# EAGLE design FloppyController1A (EAGLE 7.3.0)
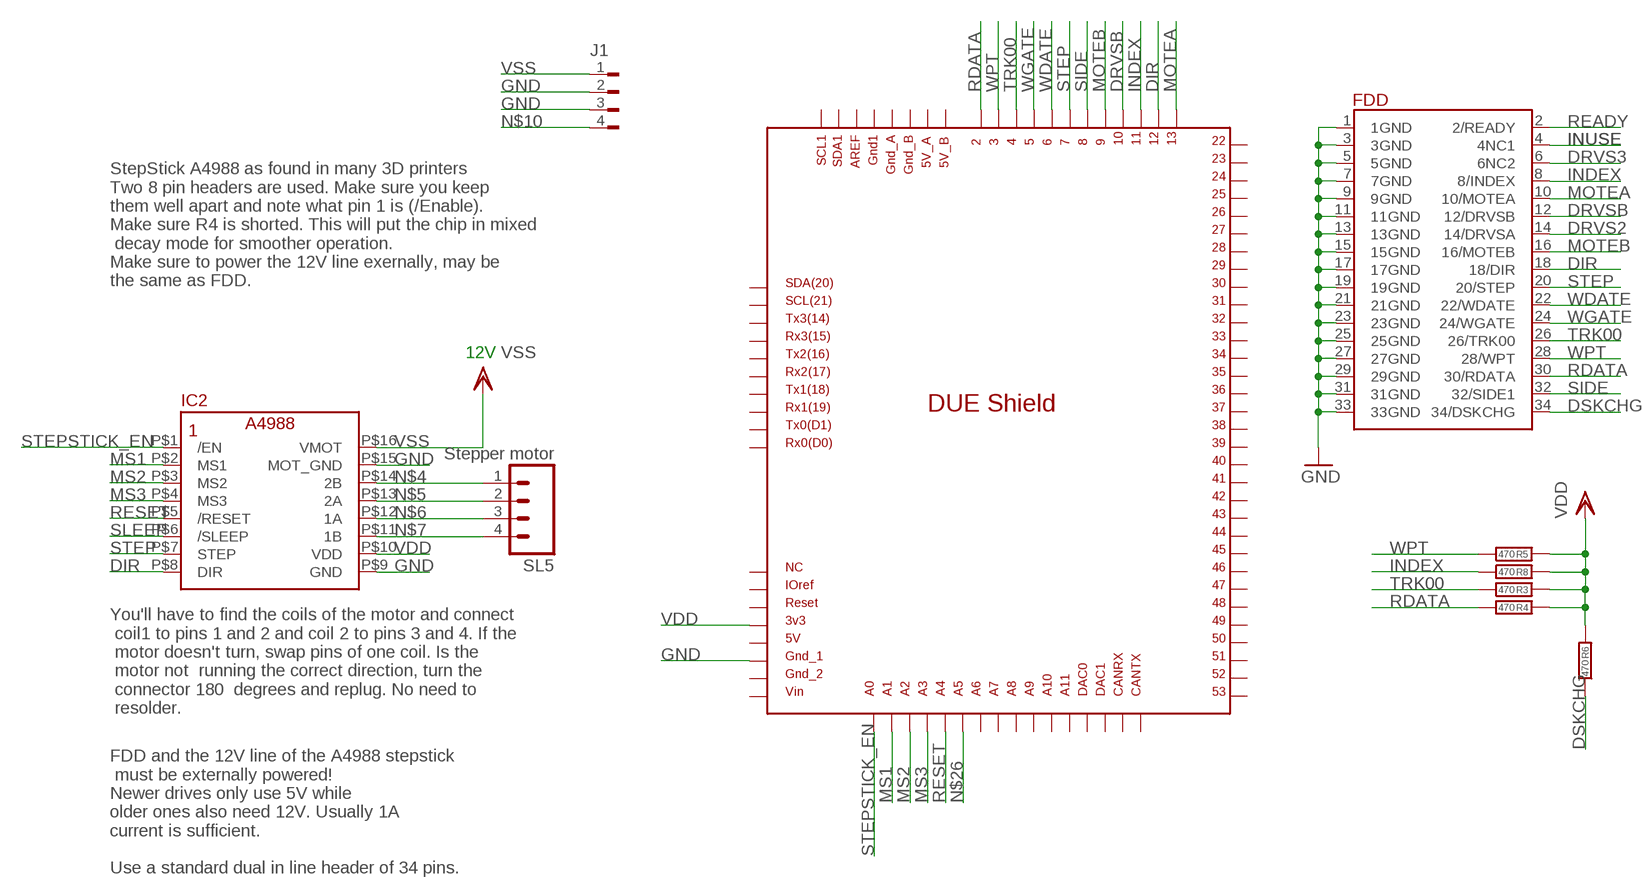
[diagram p0: schematic, sheet 1]

## Parts
FDD  FLOPPY_34PIN_CONN  [FLOPPY_34PIN_DUALROW]
IC2  STEPSTICK_A4988  [STEPSTICK_A4988]
J1  FLOP-4W827001  [827001]
R3  470  R-EU_M1206  [M1206]
R4  470  R-EU_M1206  [M1206]
R5  470  R-EU_M1206  [M1206]
R6  470  R-EU_M1206  [M1206]
R8  470  R-EU_M1206  [M1206]
SL5  Stepper motor  M04  [04P]
U$1  DUE(NOCONN)  [DUE(NORMAL_NO_CONN)]

## Nets
DIR: FDD.18(18/DIR) IC2.P$8(DIR) U$1.12
DRVS2: FDD.14(14/DRVSA)
DRVS3: FDD.6(6NC2)
DRVSB: FDD.12(12/DRVSB) U$1.10
DSKCHG: FDD.34(34/DSKCHG) R6.1
GND: FDD.1(1GND) FDD.3(3GND) FDD.5(5GND) FDD.7(7GND) FDD.9(9GND) FDD.11(11GND) FDD.13(13GND) FDD.15(15GND) FDD.17(17GND) FDD.19(19GND) FDD.21(21GND) FDD.23(23GND) FDD.25(25GND) FDD.27(27GND) FDD.29(29GND) FDD.31(31GND) FDD.33(33GND) IC2.P$9(GND) IC2.P$15(MOT_GND) J1.2 J1.3 U$1.GND_1
INDEX: FDD.8(8/INDEX) R8.1 U$1.11
INUSE: FDD.4(4NC1)
MOTEA: FDD.10(10/MOTEA) U$1.13
MOTEB: FDD.16(16/MOTEB) U$1.9
MS1: IC2.P$2(MS1) U$1.A1
MS2: IC2.P$3(MS2) U$1.A2
MS3: IC2.P$4(MS3) U$1.A3
N$4: IC2.P$14(2B) SL5.1
N$5: IC2.P$13(2A) SL5.2
N$6: IC2.P$12(1A) SL5.3
N$7: IC2.P$11(1B) SL5.4
N$10: J1.4
N$26: U$1.A5
RDATA: FDD.30(30/RDATA) R4.1 U$1.2
READY: FDD.2(2/READY)
RESET: IC2.P$5(/RESET) U$1.A4
SIDE: FDD.32(32/SIDE1) U$1.8
SLEEP: IC2.P$6(/SLEEP)
STEP: FDD.20(20/STEP) IC2.P$7(STEP) U$1.7
STEPSTICK_EN: IC2.P$1(/EN) U$1.A0
TRK00: FDD.26(26/TRK00) R3.1 U$1.4
VDD: IC2.P$10(VDD) R3.2 R4.2 R5.2 R6.2 R8.2 U$1.3V3
VSS: IC2.P$16(VMOT) J1.1
WDATE: FDD.22(22/WDATE) U$1.6
WGATE: FDD.24(24/WGATE) U$1.5
WPT: FDD.28(28/WPT) R5.1 U$1.3
Unconnected: U$1.5V U$1.5V_A U$1.5V_B U$1.22 U$1.23 U$1.24 U$1.25 U$1.26 U$1.27 U$1.28 U$1.29 U$1.30 U$1.31 U$1.32 U$1.33 U$1.34 U$1.35 U$1.36 U$1.37 U$1.38 U$1.39 U$1.40 U$1.41 U$1.42 U$1.43 U$1.44 U$1.45 U$1.46 U$1.47 U$1.48 U$1.49 U$1.50 U$1.51 U$1.52 U$1.53 U$1.A6 U$1.A7 U$1.A8 U$1.A9 U$1.A10 U$1.A11 U$1.AREF U$1.CANRX U$1.CANTX U$1.DAC0 U$1.DAC1 U$1.GND1 U$1.GND_2 U$1.GND_A U$1.GND_B U$1.IOREF U$1.NC U$1.RESET U$1.RX0 U$1.RX1 U$1.RX2 U$1.RX3 U$1.SCL U$1.SCL1 U$1.SDA U$1.SDA1 U$1.TX0 U$1.TX1 U$1.TX2 U$1.TX3 U$1.VIN

## Notes on the sheet
- StepStick A4988 as found in many 3D printers
  Two 8 pin headers are used. Make sure you keep
  them well apart and note what pin 1 is (/Enable).
  Make sure R4 is shorted. This will put the chip in mixed
   decay mode for smoother operation.
  Make sure to power the 12V line exernally, may be 
  the same as FDD.
- 12V
- You'll have to find the coils of the motor and connect
   coil1 to pins 1 and 2 and coil 2 to pins 3 and 4. If the
   motor doesn't turn, swap pins of one coil. Is the
   motor not  running the correct direction, turn the
   connector 180  degrees and replug. No need to
   resolder.
- FDD and the 12V line of the A4988 stepstick
   must be externally powered!
  Newer drives only use 5V while
  older ones also need 12V. Usually 1A
  current is sufficient. 
  
  Use a standard dual in line header of 34 pins.

## Library data of the parts
FDD = _MyComponents:FLOPPY_34PIN_CONN
IC2 = _MyComponents:STEPSTICK_A4988
J1 = con-amp:FLOP-4W: MATE N-LOCK Floppy / HDD conector Distributor: Bürklin 71F972
R3-R6 R8 = rcl:R-EU_: RESISTOR, European symbol
SL5 = con-amp-quick:M04: AMP QUICK CONNECTOR; OC_FARNELL: unknown; OC_NEWARK: unknown
U$1 = DUElib130425:DUE(NOCONN)

## Board
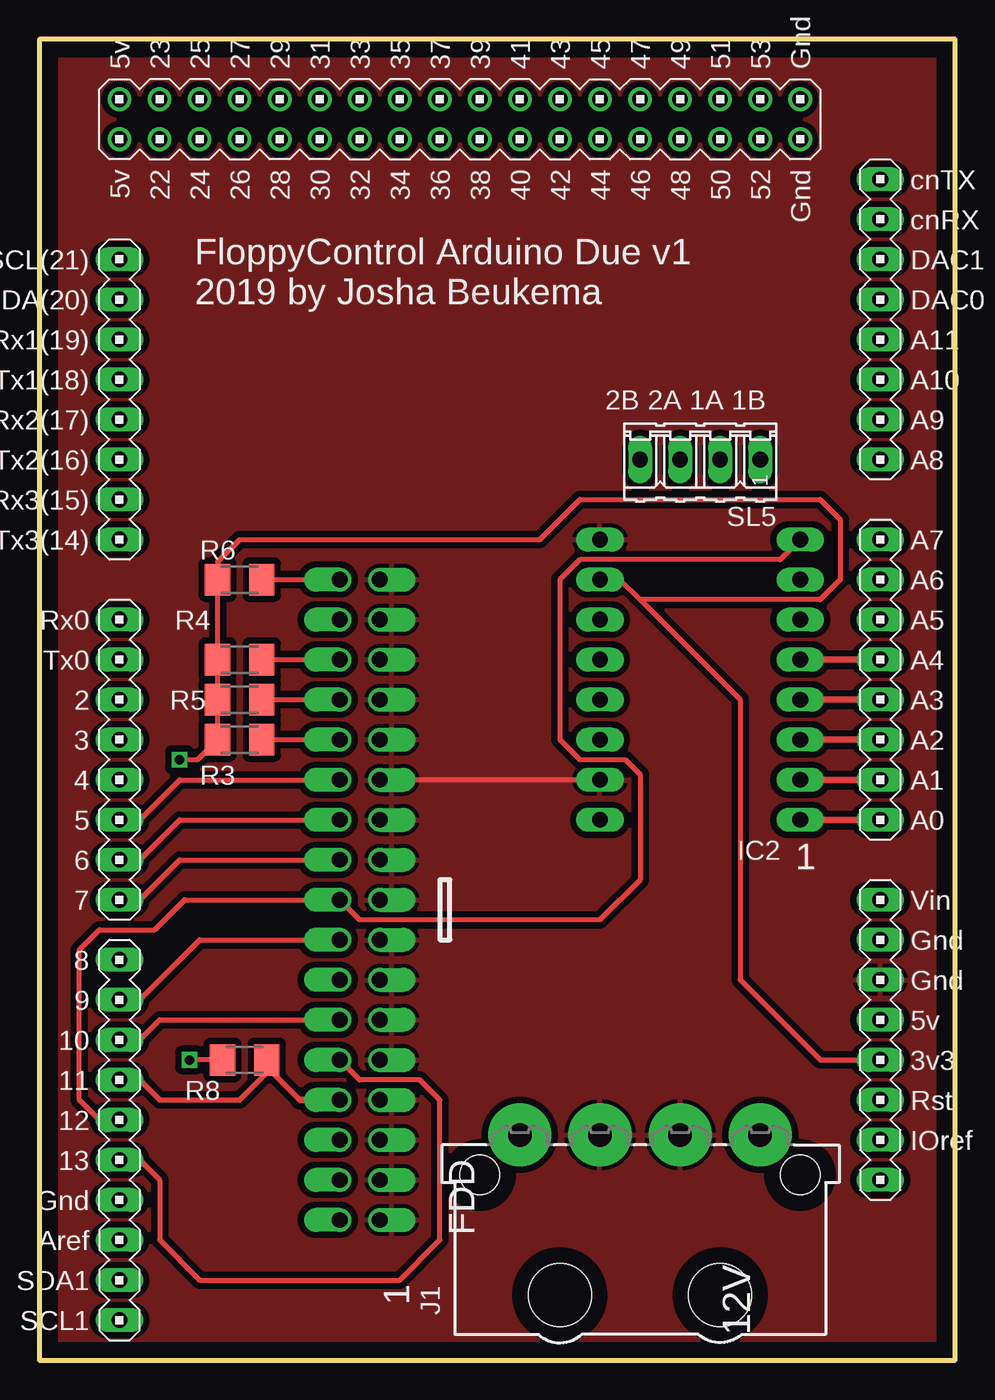
[diagram p1: board, top side]
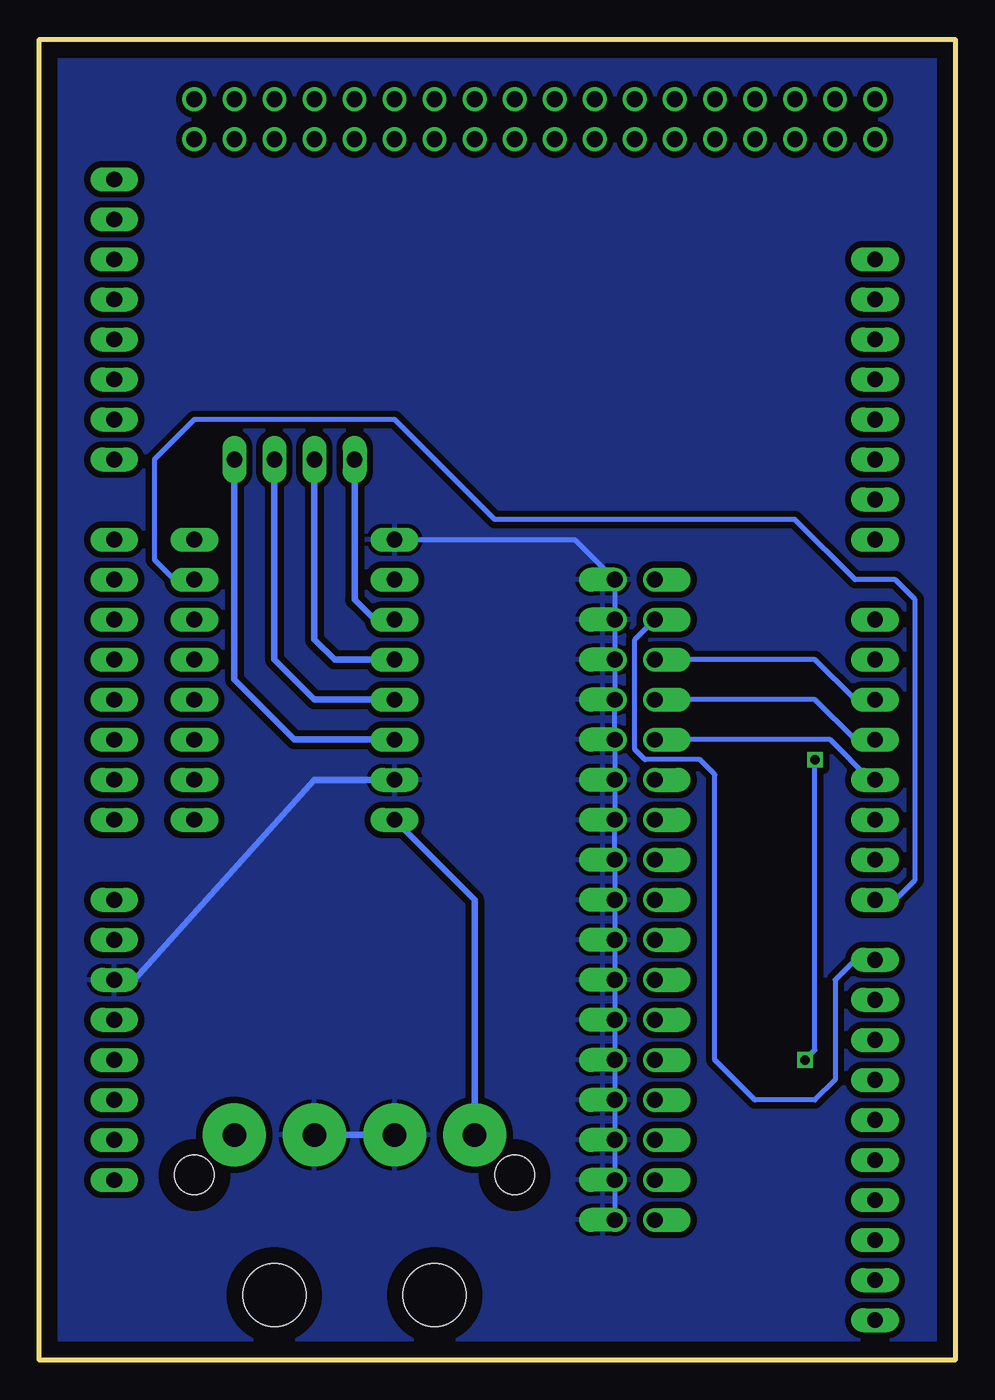
[diagram p2: board, bottom side, seen from below]

Size 58.09 x 83.81 mm. Coordinates in mm from the lower left corner, seen from the top.
Outline: 0,0 58.09,0 58.09,83.81 0,83.81 0,0
Copper layers (1*16): Top 0.035mm / dielectric 1.5mm / Bottom 0.035mm
Design rules "default": minimum track width 14mil, minimum drill 24mil, track to track 14mil, track to pad 14mil, pad to pad 14mil, via to via 14mil, smd to smd 14mil, copper to edge 40mil, drill to drill 8mil, minimum pad ring 10mil, minimum via ring 8mil, stop-mask expansion 4mil, vias tented up to drill 0mil, thermal gap 10mil

### Footprints (pad centres in the part's own frame; a part is rotated, then mirrored left to right if it is on the bottom)
FLOPPY_34PIN_DUALROW = drill 1 pad 1.422 offset: 1 0,0; 2 2.54,0; 3 0,-2.54; 4 2.54,-2.54; 5 0,-5.08; 6 2.54,-5.08; 7 0,-7.62; 8 2.54,-7.62; 9 0,-10.16; 10 2.54,-10.16; 11 0,-12.7; 12 2.54,-12.7; 13 0,-15.24; 14 2.54,-15.24; 15 0,-17.78; 16 2.54,-17.78; 17 0,-20.32; 18 2.54,-20.32; 19 0,-22.86; 20 2.54,-22.86; 21 0,-25.4; 22 2.54,-25.4; 23 0,-27.94; 24 2.54,-27.94; 25 0,-30.48; 26 2.54,-30.48; 27 0,-33.02; 28 2.54,-33.02; 29 0,-35.56; 30 2.54,-35.56; 31 0,-38.1; 32 2.54,-38.1; 33 0,-40.64; 34 2.54,-40.64
STEPSTICK_A4988 = drill 1 pad 1.422 long: P$1 0,0; P$2 0,-2.54; P$3 0,-5.08; P$4 0,-7.62; P$5 0,-10.16; P$6 0,-12.7; P$7 0,-15.24; P$8 0,-17.78; P$9 12.7,-17.78; P$10 12.7,-15.24; P$11 12.7,-12.7; P$12 12.7,-10.16; P$13 12.7,-7.62; P$14 12.7,-5.08; P$15 12.7,-2.54; P$16 12.7,0
827001 = drill 1.5 pad 4: 1 -7.62,0; 2 -2.54,0; 3 2.54,0; 4 7.62,0 | hole 4: 5.08,-10.16; -5.08,-10.16 | hole 2.5: 10.16,-2.54; -10.16,-2.54
M1206 = smd 1.6 x 2: 1 -1.4,0; 2 1.4,0
04P = drill 1 pad 1.422 long: 1 -3.81,0; 2 -1.27,0; 3 1.27,0; 4 3.81,0
DUE(NORMAL_NO_CONN) = drill 1 long: 2 3.81,22.86; 3 1.27,22.86; 3V3 -19.05,-25.4; 4 -1.27,22.86; 5 -3.81,22.86; 5V -16.51,-25.4; 6 -6.35,22.86; 7 -8.89,22.86; 8 -12.7,22.86; 9 -15.24,22.86; 10 -17.78,22.86; 11 -20.32,22.86; 12 -22.86,22.86; 13 -25.4,22.86; A0 -3.81,-25.4; A1 -1.27,-25.4; A2 1.27,-25.4; A3 3.81,-25.4; A4 6.35,-25.4; A5 8.89,-25.4; A6 11.43,-25.4; A7 13.97,-25.4; A8 19.05,-25.4; A9 21.59,-25.4; A10 24.13,-25.4; A11 26.67,-25.4; AREF -30.48,22.86; CANRX 34.29,-25.4; CANTX 36.83,-25.4; DAC0 29.21,-25.4; DAC1 31.75,-25.4; GND1 -27.94,22.86; GND_1 -13.97,-25.4; GND_2 -11.43,-25.4; RESET -21.59,-25.4; RX0 8.89,22.86; RX1 26.67,22.86; RX2 21.59,22.86; RX3 16.51,22.86; SCL 31.75,22.86; SDA 29.21,22.86; TX0 6.35,22.86; TX1 24.13,22.86; TX2 19.05,22.86; TX3 13.97,22.86; VIN -8.89,-25.4 | drill 1: 5V_A 39.37,22.86; 5V_B 41.91,22.86; 22 39.37,20.32; 23 41.91,20.32; 24 39.37,17.78; 25 41.91,17.78; 26 39.37,15.24; 27 41.91,15.24; 28 39.37,12.7; 29 41.91,12.7; 30 39.37,10.16; 31 41.91,10.16; 32 39.37,7.62; 33 41.91,7.62; 34 39.37,5.08; 35 41.91,5.08; 36 39.37,2.54; 37 41.91,2.54; 38 39.37,0; 39 41.91,0; 40 39.37,-2.54; 41 41.91,-2.54; 42 39.37,-5.08; 43 41.91,-5.08; 44 39.37,-7.62; 45 41.91,-7.62; 46 39.37,-10.16; 47 41.91,-10.16; 48 39.37,-12.7; 49 41.91,-12.7; 50 39.37,-15.24; 51 41.91,-15.24; 52 39.37,-17.78; 53 41.91,-17.78; GND_A 39.37,-20.32; GND_B 41.91,-20.32 | drill 1 pad 1.422 long: IOREF -24.13,-25.4; NC -26.67,-25.4; SCL1 -35.56,22.86; SDA1 -33.02,22.86

### Placement (x,y rotation side)
FDD  21.59,8.89 180 top
IC2  48.26,34.29 180 top
J1  38.1,14.29 0 top
R3  12.7,39.37 180 top
R4  12.7,44.45 180 top
R5  12.7,41.91 180 top
R6  12.7,49.53 180 top
R8  13.02,19.05 180 top
SL5  41.91,57.15 180 top
U$1  27.94,38.1 90 top

### Tracks (layer width: path | path; a pad name or v marks a point on that pad's centre or on a via)
DIR
  Top 0.305: U$1.12 3.81,15.24 2.54,16.51 2.54,26.04 3.81,27.3 7.3,27.3 9.21,29.21 FDD.18 20.32,27.94 35.56,27.94 38.1,30.48 38.1,37.15 37.15,38.1 34.29,38.1 33.02,39.37 33.02,49.53 34.29,50.8 46.99,50.8 IC2.P$8
DRVSB
  Top 0.305: 6.35,20.32 7.62,21.59 FDD.12
  Top 0.406: U$1.10 6.35,20.32
DSKCHG
  Top 0.305: R6.1 FDD.34
GND
  Top 0.305: IC2.P$15 FDD.23
  Bottom 0.305: FDD.1 FDD.3 FDD.5 FDD.7 FDD.9 FDD.11 FDD.13 FDD.15 FDD.17 FDD.19 FDD.21 FDD.23 FDD.25 FDD.27 FDD.29 FDD.31 FDD.33 24.13,52.07 IC2.P$9
  Bottom 0.406: U$1.GND_1 52.07,24.13 40.64,36.83 IC2.P$15 | J1.2 J1.3
  pour Top (isolate 0.406): 0,83.82 58.1,83.82 58.1,0 0,0
  pour Bottom (isolate 0.406): 0,83.82 58.1,83.82 58.1,0 0,0
INDEX
  Top 0.305: 14.42,18.6 14.61,18.41 | 14.61,18.41 16.51,16.51 | U$1.11 6.35,17.78 7.62,16.51 12.7,16.51 14.61,18.41
  Top 0.406: R8.1 14.42,18.6 | 16.51,16.51 FDD.8
MOTEA
  Top 0.305: U$1.13 6.35,12.7 7.62,11.43 7.62,7.62 10.16,5.08 22.86,5.08 25.4,7.62 25.4,16.51 24.13,17.78 20.32,17.78 FDD.10
MOTEB
  Top 0.305: U$1.9 6.35,22.86 10.16,26.67 FDD.16
MS1
  Top 0.406: IC2.P$2 U$1.A1
MS2
  Top 0.406: IC2.P$3 U$1.A2
MS3
  Top 0.406: IC2.P$4 U$1.A3
N$4
  Bottom 0.406: SL5.1 45.72,43.18 41.91,39.37 IC2.P$14
N$5
  Bottom 0.406: SL5.2 43.18,44.45 40.64,41.91 IC2.P$13
N$6
  Bottom 0.406: SL5.3 40.64,45.72 39.37,44.45 IC2.P$12
N$7
  Bottom 0.406: SL5.4 38.1,48.26 36.83,46.99 IC2.P$11
RDATA
  Top 0.305: R4.1 FDD.30
  Bottom 0.305: 6.35,41.91 8.89,44.45 FDD.30
  Bottom 0.406: U$1.2 6.35,41.91
RESET
  Top 0.406: IC2.P$5 U$1.A4
SIDE
  Bottom 0.305: 17.46,46.99 FDD.32 20.32,45.72 20.32,38.73 19.68,38.1 16.19,38.1 15.24,37.15 15.24,19.05 12.7,16.51 8.89,16.51 7.62,17.78 7.62,24.13 6.35,25.4 U$1.8
STEP
  Top 0.305: U$1.7 6.35,29.21 8.89,31.75 FDD.20
  Bottom 0.305: U$1.7 3.81,29.21 2.54,30.48 2.54,48.26 3.81,49.53 6.35,49.53 10.16,53.34 29.21,53.34 35.56,59.69 48.26,59.69 50.8,57.15 50.8,50.8 49.53,49.53 IC2.P$7
STEPSTICK_EN
  Top 0.406: IC2.P$1 U$1.A0
TRK00
  Top 0.305: R3.1 FDD.26
  Bottom 0.305: 5.4,36.83 7.94,39.37 FDD.26
  Bottom 0.406: U$1.4 5.4,36.83
VDD  (via drill 0.6)
  Top 0.305: 36.83,49.53 38.1,48.26 | 38.1,48.26 44.45,41.91 44.45,24.13 49.53,19.05 U$1.3V3 | R8.2 v9.53,19.05 | v8.89,38.1 10.03,38.1 R3.2 | 38.1,48.26 49.53,48.26 50.8,49.53 50.8,53.34 49.53,54.61 34.29,54.61 31.75,52.07 12.7,52.07 11.3,50.67 R6.2 R3.2 | R3.2 R5.2 R4.2
  Top 0.406: IC2.P$10 36.83,49.53
  Bottom 0.305: v9.53,19.05 8.89,19.68 v8.89,38.1
VSS
  Bottom 0.406: IC2.P$16 30.48,29.21 J1.1
WDATE
  Top 0.305: U$1.6 6.35,31.75 8.89,34.29 FDD.22
WGATE
  Top 0.305: U$1.5 6.35,34.29 8.89,36.83 FDD.24
WPT
  Top 0.305: R5.1 FDD.28
  Bottom 0.305: 6.35,39.37 8.89,41.91 FDD.28
  Bottom 0.406: U$1.3 6.35,39.37

### Text on the board
tNames: FloppyControl Arduino Due v1 / 2019 by Josha Beukema | 2B 2A 1A 1B | 1 | 1 | 12V